# EAGLE design breakout_v0.4 (EAGLE 9.3.2)
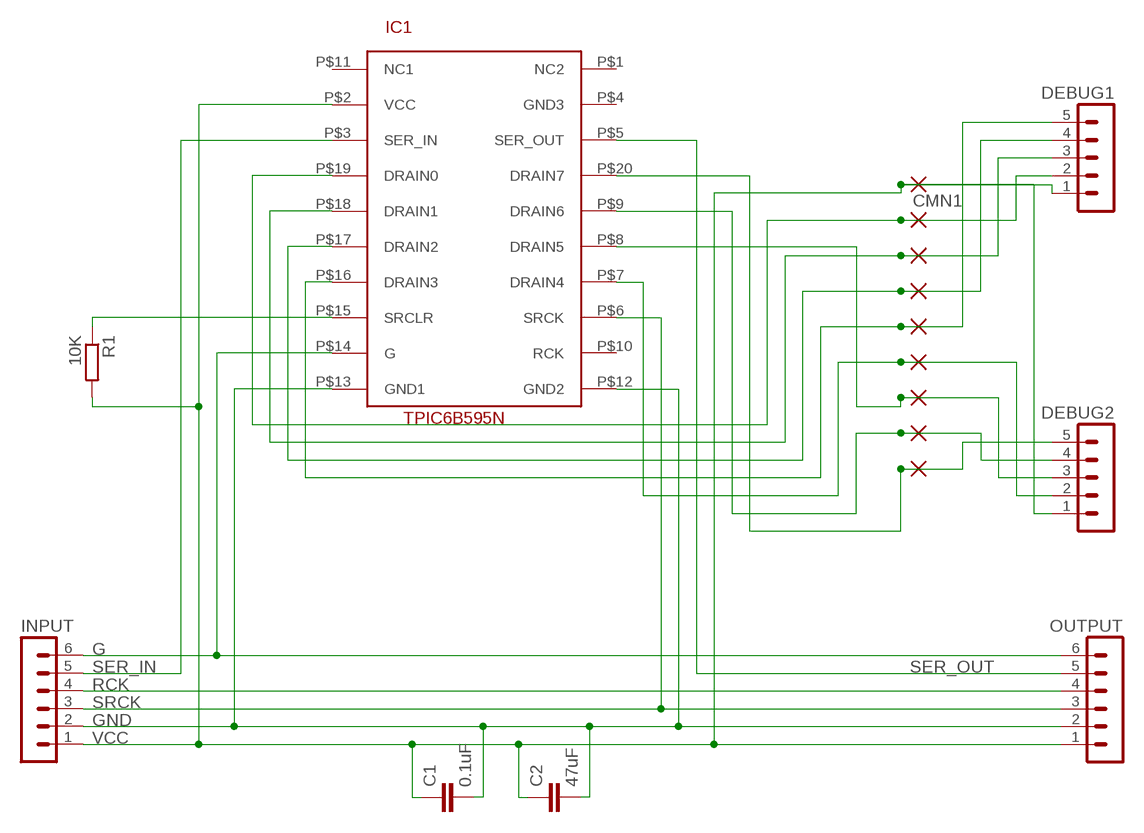
[diagram p0: schematic, sheet 1]

## Parts
C1  0.1uF  RCL_C-EU025-025X050  [RCL_C025-025X050]
C2  47uF  RCL_C-EU025-025X050  [RCL_C025-025X050]
CMN1  1,6/0,8  [1,6/0,8]
DEBUG1  MA05-1  [MA05-1]
DEBUG2  MA05-1  [MA05-1]
DEC1  1,6/0,8  [1,6/0,8]
INPUT  CON-LSTB_MA06-1  [CON-LSTB_MA06-1]
OUTPUT  CON-LSTB_MA06-1  [CON-LSTB_MA06-1]
R1  10K  RCL_R-EU_0207/7  [RCL_0207/7]
SEGA1  1,6/0,8  [1,6/0,8]
SEGB1  1,6/0,8  [1,6/0,8]
SEGC1  1,6/0,8  [1,6/0,8]
SEGD1  1,6/0,8  [1,6/0,8]
SEGE1  1,6/0,8  [1,6/0,8]
SEGF1  1,6/0,8  [1,6/0,8]
SEGG1  1,6/0,8  [1,6/0,8]
U$1  TPIC6B595N_TPIC6B595NPDIP-20  [TPIC6B595N_PDIP-20]

## Nets
G: INPUT.6 OUTPUT.6 U$1.P$14(G)
GND [ground]: C1.2 C2.2 INPUT.2 OUTPUT.2 U$1.P$12(GND2) U$1.P$13(GND1)
N$1: R1.1 U$1.P$15(SRCLR)
N$2: DEBUG1.2 SEGA1.1(P) U$1.P$19(DRAIN0)
N$3: DEBUG1.3 SEGB1.1(P) U$1.P$18(DRAIN1)
N$4: DEBUG1.4 SEGC1.1(P) U$1.P$17(DRAIN2)
N$5: DEBUG1.5 SEGD1.1(P) U$1.P$16(DRAIN3)
N$6: DEBUG2.2 SEGE1.1(P) U$1.P$7(DRAIN4)
N$7: DEBUG2.3 SEGF1.1(P) U$1.P$8(DRAIN5)
N$8: DEBUG2.4 SEGG1.1(P) U$1.P$9(DRAIN6)
N$9: DEBUG2.5 DEC1.1(P) U$1.P$20(DRAIN7)
RCK: INPUT.4 OUTPUT.4
SER_IN: INPUT.5 U$1.P$3(SER_IN)
SER_OUT: OUTPUT.5 U$1.P$5(SER_OUT)
SRCK: INPUT.3 OUTPUT.3 U$1.P$6(SRCK)
VCC [vcc]: C1.1 C2.1 CMN1.1(P) DEBUG1.1 DEBUG2.1 INPUT.1 OUTPUT.1 R1.2 U$1.P$2(VCC)
Unconnected: U$1.P$1(NC2) U$1.P$4(GND3) U$1.P$10(RCK) U$1.P$11(NC1)

## Library data of the parts
C1 C2 = v0.4:RCL_C-EU: CAPACITOR, European symbol; SPICEPREFIX: C
CMN1 DEC1 SEGA1 SEGB1 SEGC1 SEGD1 SEGE1 SEGF1 SEGG1 = wirepad:1,6/0,8: THROUGH-HOLE PAD
DEBUG1 DEBUG2 = con-lstb:MA05-1: PIN HEADER; OC_FARNELL: unknown; OC_NEWARK: unknown
INPUT OUTPUT = v0.4:CON-LSTB_MA06-1: PIN HEADER; OC_FARNELL: unknown; OC_NEWARK: unknown
R1 = v0.4:RCL_R-EU_: RESISTOR, European symbol; SPICEPREFIX: R
U$1 = v0.4:TPIC6B595N_TPIC6B595N

## Net classes
0 default: width 0.635 mm
1 vcc: width 1.27 mm
2 ground: width 1.27 mm

## Board
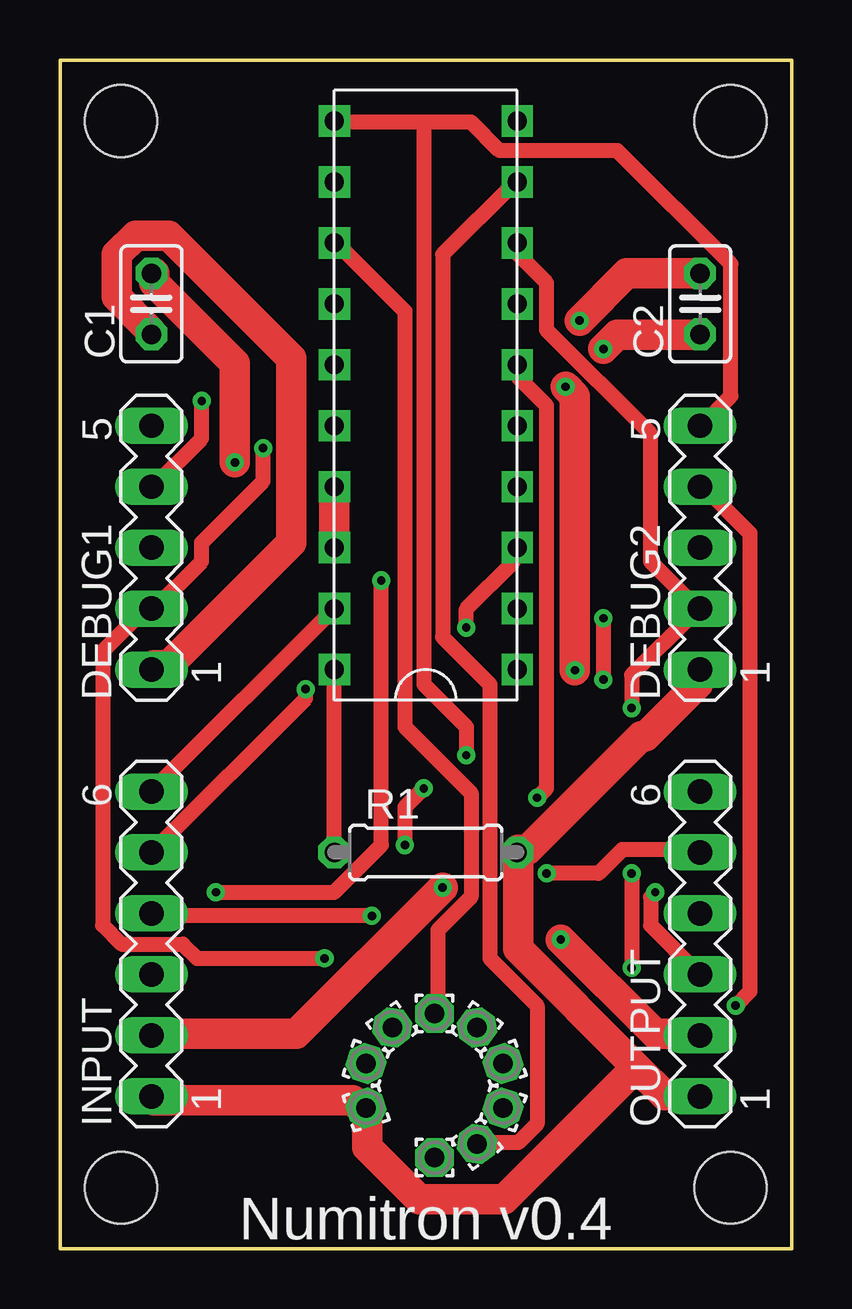
[diagram p1: board, top side]
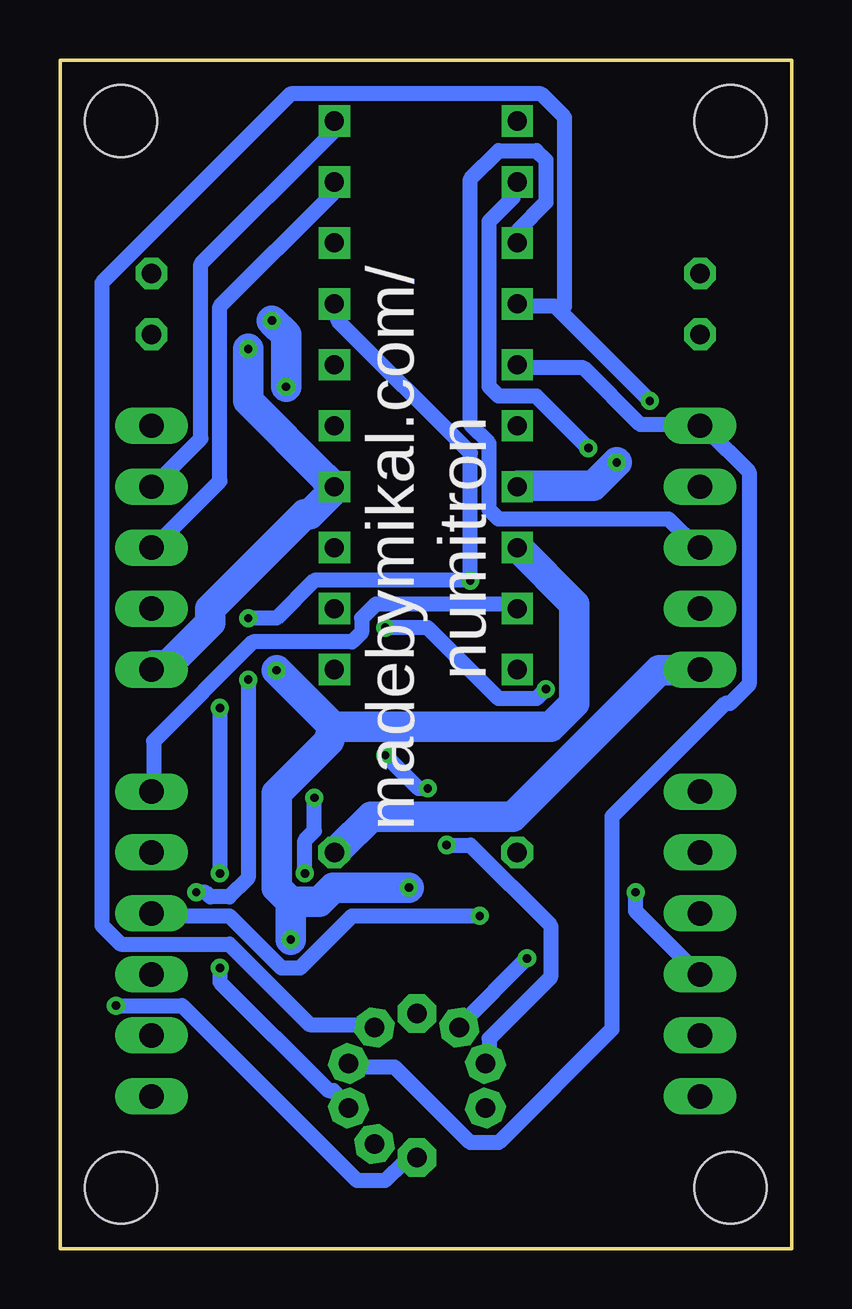
[diagram p2: board, bottom side, seen from below]

Size 30.48 x 49.53 mm. Coordinates in mm from the lower left corner, seen from the top.
Outline: 0,0 0,49.53 30.48,49.53 30.48,0 0,0
Copper layers (1*16): Top 0.035mm / dielectric 1.5mm / Bottom 0.035mm
Design rules "default": minimum track width 6mil, minimum drill 0.35mm, track to track 6mil, track to pad 6mil, pad to pad 6mil, via to via 6mil, smd to smd 6mil, copper to edge 40mil, drill to drill 6mil, minimum pad ring 10mil, minimum via ring 8mil, stop-mask expansion 4mil, vias tented up to drill 0mil, thermal gap 10mil
Holes 3 mm at 2.54,2.54 27.94,2.54 27.94,46.99 2.54,46.99

### Footprints (pad centres in the part's own frame; a part is rotated, then mirrored left to right if it is on the bottom)
RCL_C025-025X050 = drill 0.813 octagon: 1 -1.27,0; 2 1.27,0
1,6/0,8 = drill 0.813 pad 1.6 octagon: 1 0,0
MA05-1 = drill 1.016 long: 1 -5.08,0; 2 -2.54,0; 3 0,0; 4 2.54,0; 5 5.08,0
CON-LSTB_MA06-1 = drill 1.016 long: 1 -6.35,0; 2 -3.81,0; 3 -1.27,0; 4 1.27,0; 5 3.81,0; 6 6.35,0
RCL_0207/7 = drill 0.813 octagon: 1 -3.81,0; 2 3.81,0
TPIC6B595N_PDIP-20 = drill 0.8 square: P$1 -3.81,1.27; P$2 -3.81,3.81; P$3 -3.81,6.35; P$4 -3.81,8.89; P$5 -3.81,-1.27; P$6 -3.81,-3.81; P$7 -3.81,-6.35; P$8 -3.81,-8.89; P$9 -3.81,-11.43; P$10 -3.81,11.43; P$11 3.81,1.27; P$12 3.81,3.81; P$13 3.81,6.35; P$14 3.81,8.89; P$15 3.81,11.43; P$16 3.81,-1.27; P$17 3.81,-3.81; P$18 3.81,-6.35; P$19 3.81,-8.89; P$20 3.81,-11.43

### Placement (x,y rotation side)
C1  3.81,39.37 90 top
C2  26.67,39.37 90 top
CMN1  12.75,5.87 198 top
DEBUG1  3.81,29.21 90 top
DEBUG2  26.67,29.21 90 top
DEC1  12.75,7.72 162 top
INPUT  3.81,12.7 90 top
OUTPUT  26.67,12.7 90 top
R1  15.24,16.51 0 top
SEGA1  13.84,9.22 126 top
SEGB1  15.61,9.79 90 top
SEGC1  17.37,9.22 144 top
SEGD1  18.46,7.72 18 top
SEGE1  18.46,5.87 342 top
SEGF1  17.37,4.37 306 top
SEGG1  15.61,3.79 270 top
U$1  15.24,35.56 180 top

### Tracks (layer width: path | path; a pad name or v marks a point on that pad's centre or on a via)
G
  Top 0.635: U$1.P$14 11.42,26.66 3.94,19.18 INPUT.6
  Bottom 0.635: OUTPUT.6 26.57,19.18 26.57,21.15 22.44,25.29 18.31,25.29 17.91,25.68 17.91,26.27 17.32,26.86 11.61,26.86 U$1.P$14
GND  (via drill 0.35)
  Top 1.27: U$1.P$13 11.42,29.22 11.42,31.59 U$1.P$12 | v7.28,32.77 7.28,36.9 3.94,40.25 3.94,40.64 C1.2 | C2.2 23.62,40.64 v21.65,38.67 | v21.06,35.92 21.46,35.52 v21.46,24.11 | v15.95,15.05 9.84,8.95 3.94,8.95 INPUT.2 | v20.87,12.88 24.8,8.95 26.57,8.95 OUTPUT.2
  Bottom 1.27: v7.28,32.77 8.27,31.78 11.42,31.78 U$1.P$12 | v21.65,38.67 21.06,38.08 v21.06,35.92 | 19.09,21.74 v21.46,24.11 | 19.09,21.74 10.04,21.74 9.05,22.73 9.05,26.86 11.42,29.22 U$1.P$13 | v15.95,15.05 19.09,15.05 19.68,14.46 20.87,14.46 | 20.87,14.46 21.46,15.05 21.46,18.99 19.29,21.15 19.09,21.74 | 20.87,14.46 v20.87,12.88
N$1
  Top 0.635: U$1.P$15 11.42,24.11 11.42,16.62 R1.1
N$2  (via drill 0.35)
  Top 0.635: v8.46,33.36 8.46,31.98 5.91,29.42 5.91,28.63 3.94,26.66 DEBUG1.2 3.54,26.66 1.77,24.89 1.77,13.47 2.56,12.69 5.12,12.69 5.71,12.1 v11.02,12.1
  Bottom 0.635: v8.46,33.36 10.63,35.52 12.21,35.52 12.6,35.92 12.6,42.8 11.61,43.79 11.61,44.38 U$1.P$19 | v11.02,12.1 13.78,9.34 SEGA1.1
N$3
  Top 0.635: SEGB1.1 15.75,9.93 15.75,13.28 17.13,14.66 17.13,18.99 14.37,21.74 14.37,39.07 11.61,41.82 U$1.P$18
  Bottom 0.635: U$1.P$18 11.42,42.02 11.42,42.41 10.24,43.59 10.24,45.36 10.63,45.76 12.21,45.76 13.39,44.58 13.39,34.34 12.6,33.55 12.6,30.8 12.21,30.4 5.12,30.4 3.94,29.22 DEBUG1.3
N$4  (via drill 0.35)
  Top 0.635: v5.91,35.33 5.91,33.75 3.94,31.78 DEBUG1.4
  Bottom 0.635: v5.91,35.33 9.65,39.07 | 9.65,39.07 9.84,39.26 11.42,39.26 U$1.P$17 | SEGC1.1 17.52,9.34 20.08,9.34 23.43,12.69 27.95,12.69 28.74,13.47 28.74,40.25 20.87,48.12 10.43,48.12 9.45,47.14 9.45,39.26 9.65,39.07
N$5
  Bottom 0.635: U$1.P$16 11.42,36.7 8.66,36.7 6.3,34.34 3.94,34.34 DEBUG1.5 3.54,34.14 1.77,32.37 1.77,23.51 2.56,22.73 2.76,22.73 7.48,18 7.48,9.14 12.21,4.42 13.39,4.42 16.54,7.57 18.31,7.57 SEGD1.1
N$6  (via drill 0.35)
  Top 0.635: U$1.P$7 19.09,41.82 19.09,41.43 20.28,40.25 20.28,38.28 24.61,33.95 24.61,28.63 26.57,26.66 DEBUG2.2 26.38,26.47 23.82,23.91 v23.82,22.53 | v23.82,15.64 v23.82,11.7
  Bottom 0.635: v23.82,11.7 23.82,11.11 19.29,6.59 19.09,6.59 18.5,5.99 SEGE1.1 | v23.82,22.53 v23.82,15.64
N$7
  Top 0.635: SEGF1.1 17.52,4.42 19.09,4.42 19.88,5.21 19.88,10.13 17.91,12.1 17.91,23.51 15.95,25.48 15.95,41.43 18.9,44.38 U$1.P$8
  Bottom 0.635: U$1.P$8 19.09,44.38 19.09,43.99 23.82,39.26 23.82,31.98 26.57,29.22 DEBUG2.3
N$8  (via drill 0.35)
  Top 0.635: v28.15,10.13 28.74,10.72 28.74,29.81 26.77,31.78 DEBUG2.4
  Bottom 0.635: U$1.P$9 19.09,46.94 19.09,46.55 24.61,41.03 24.61,33.75 26.57,31.78 DEBUG2.4 | v28.15,10.13 25.39,10.13 18.11,2.84 16.93,2.84 16.14,3.63 15.75,3.63 SEGG1.1
N$9  (via drill 0.35)
  Top 0.635: 15.16,46.94 17.13,46.94 18.31,45.76 23.23,45.76 27.95,41.03 27.95,35.52 26.77,34.34 DEBUG2.5 | 15.16,46.94 11.61,46.94 U$1.P$20 | v14.37,16.82 14.37,18.4 v15.16,19.18 | v16.93,20.56 16.93,21.74 15.16,23.51 15.16,46.94
  Bottom 0.635: v14.37,16.82 13.39,16.82 10.04,13.47 10.04,11.31 12.6,8.75 12.6,7.77 DEC1.1 | v15.16,19.18 15.55,19.18 v16.93,20.56
RCK  (via drill 0.35)
  Top 0.635: v12.99,13.87 3.94,13.87 INPUT.4
  Bottom 0.635: v12.99,13.87 18.31,13.87 20.47,11.7 21.26,11.7 23.43,13.87 26.57,13.87 OUTPUT.4
SER_IN  (via drill 0.35)
  Top 0.635: v16.93,25.88 16.93,26.66 18.9,28.63 18.9,29.03 U$1.P$3 | v10.24,23.32 10.24,22.92 3.94,16.62 INPUT.5
  Bottom 0.635: v16.93,25.88 15.16,25.88 12.21,22.92 10.63,22.92 v10.24,23.32
SER_OUT  (via drill 0.35)
  Top 0.635: v19.88,18.79 20.28,19.18 20.28,35.13 19.09,36.31 19.09,36.7 U$1.P$5 | v20.28,15.64 22.44,15.64 23.43,16.62 26.57,16.62 OUTPUT.5
  Bottom 0.635: v19.88,18.79 19.88,17.41 20.28,17.02 v20.28,15.64
SRCK  (via drill 0.35)
  Top 0.635: v13.39,27.84 13.39,16.82 11.42,14.85 v6.5,14.85 | v24.8,14.85 24.61,14.66 24.61,13.47 26.57,11.51 OUTPUT.3 | v22.64,26.27 v22.64,23.71
  Bottom 0.635: v6.5,14.85 6.5,14.06 3.94,11.51 INPUT.3 | U$1.P$6 18.9,39.26 18.9,38.67 13.39,33.16 v13.39,27.84 19.88,27.84 21.46,26.27 v22.64,26.27 | v24.8,14.85 24.41,14.85 24.21,14.66 23.43,14.66 22.64,15.44 v22.64,23.71
VCC  (via drill 0.35)
  Top 1.27: C1.1 3.74,38.28 2.36,39.66 2.36,41.43 3.15,42.22 4.53,42.22 9.65,37.1 9.65,29.42 4.53,24.3 3.94,24.3 DEBUG1.1 | INPUT.1 3.94,6.19 12.21,6.19 12.6,5.8 CMN1.1 12.79,5.21 12.79,4.22 14.96,2.06 18.5,2.06 24.02,7.57 | DEBUG2.1 26.57,24.11 26.57,23.51 24.41,21.35 24.21,21.35 19.49,16.62 19.09,16.62 R1.2 19.09,16.03 19.09,12.49 24.02,7.57 | v22.64,37.49 23.23,38.08 26.57,38.08 C2.1 | 24.02,7.57 25.2,6.39 26.57,6.39 OUTPUT.1
  Bottom 1.27: DEBUG2.1 26.57,24.3 25.98,24.3 24.21,26.07 24.21,26.66 20.28,30.6 20.08,30.6 19.09,31.59 U$1.P$2 19.49,32.18 22.64,35.33 v22.64,37.49 | DEBUG1.1 3.94,24.11 5.51,24.11 11.61,18 17.52,18 18.9,16.62 R1.2

### Text on the board
tPlace: Numitron v0.4
bPlace: madebymikal.com/ / numitron